# Altium project PS Digital Test v1.0.0.PrjPcb
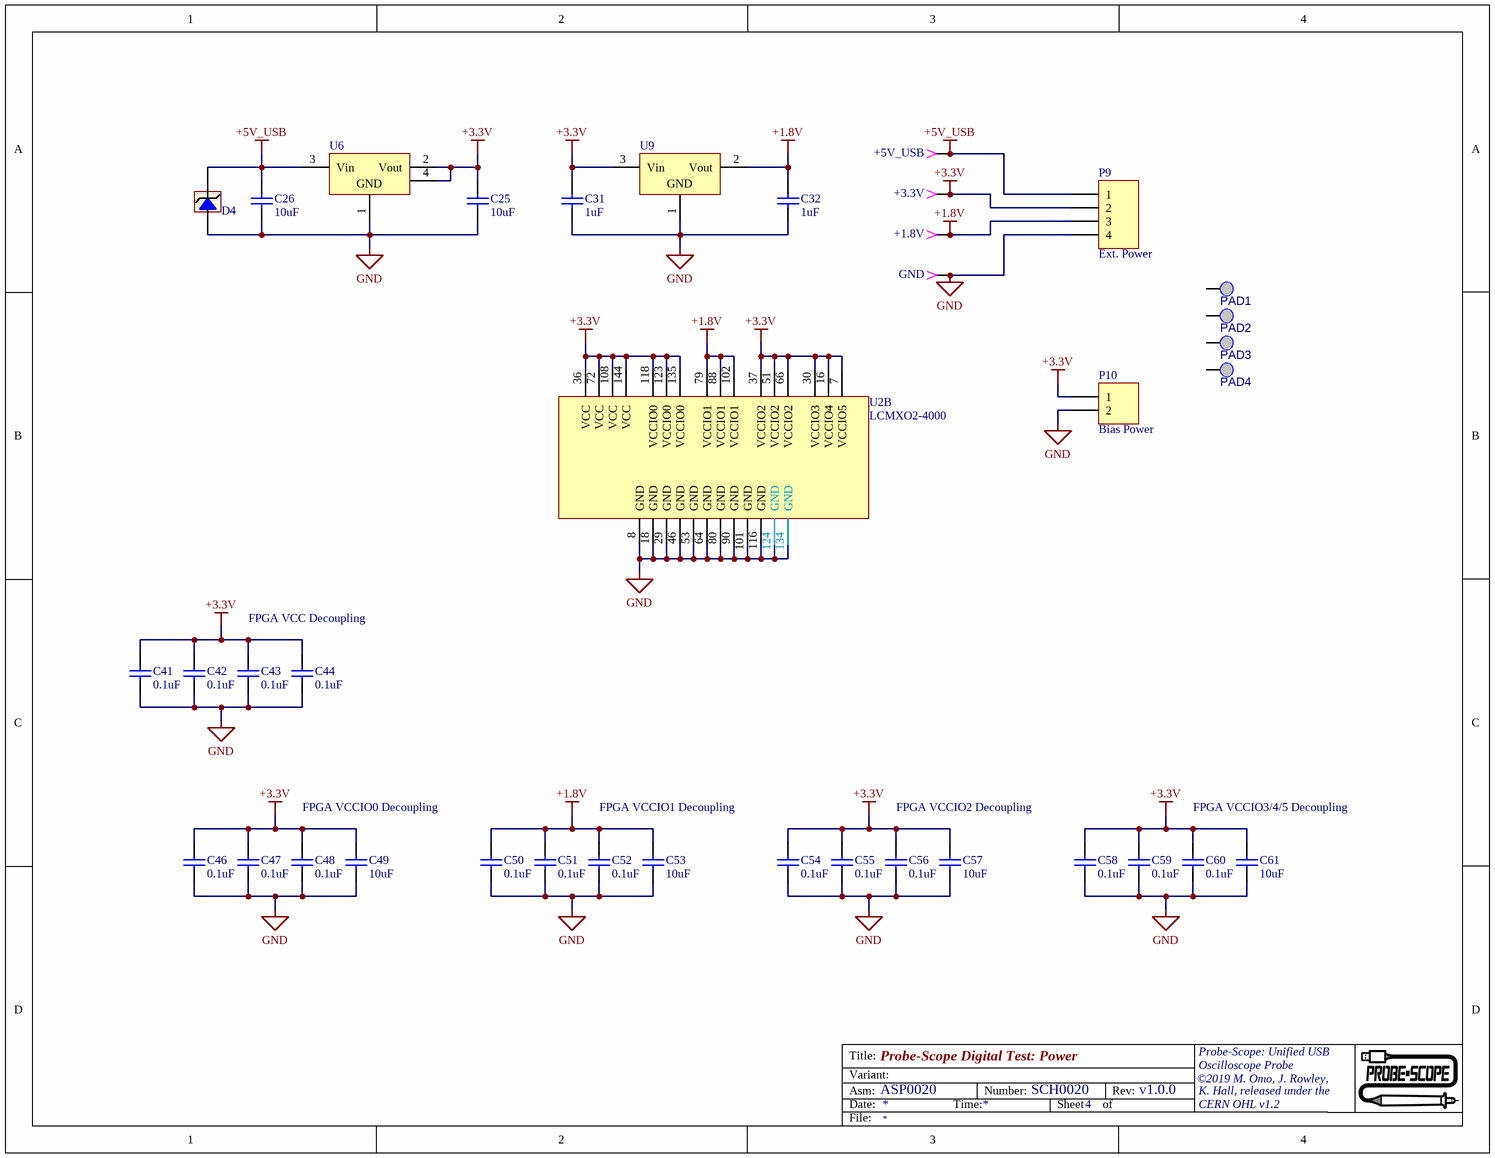
[diagram p0: PSDT Power v1.0.0.SchDoc]
sheetcount: 4; revisionfull: v1.0.0; revision: v1.0
4 sheets, 120 parts. Net scope: global (net labels, ports and power ports of the same name join across sheets).
Board file: PS Digital Test v1.0.PcbDoc
Sheets:
  PSDT Power v1.0.0.SchDoc
  PSDT RAM v1.0.0.SchDoc
  PSDT Controller v1.0.0.SchDoc
  PSDT ADC v1.0.0.SchDoc

## Sheet PSDT Power v1.0.0.SchDoc: Probe-Scope Digital Test: Power
size Letter; CompanyName: Probe-Scope; Organization: Probe-Scope; Address1: Probe-Scope: Unified USB; Address2: Oscilloscope Probe; Address3: ©2019 M. Omo, J. Rowley,; Address4: K. Hall, released under the; DocumentNumber: SCH0020; SheetNumber: 4; SheetTotal: 4; PageSetup: Record=PageOptions|CenterHorizontal=True|CenterVertical=True|PrintScale=0.96|XCorrection=1.00|YCorrection=1.00|PrintKind=1|BorderSize=5000000|LeftOffset=0|BottomOffset=0|Orientation=2|PaperLength=1000|PaperWidth=1000|Scale=100|PaperSource=7|PrintQuality=-4|MediaType=1|DitherType=10|PaperKind=11x17|PrintScaleMode=1; Assembly: ASP0020; License: CERN OHL v1.2

### Parts
+1.8V  TP  [TESTPOINT024]  (value not drawn)
+3.3V  TP  [TESTPOINT024]  (value not drawn)
+5V_USB  TP  [TESTPOINT024]  (value not drawn)
C25  value 10uF  [0603(1608)]  (hidden comment: 25V)
C26  value 10uF  [0603(1608)]  (hidden comment: 25V)
C31  value 1uF  [0402(1005)]  (hidden comment: 10V)
C32  value 1uF  [0402(1005)]  (hidden comment: 10V)
C41  value 0.1uF  [0402(1005)]  (hidden comment: 6.3V)
C42  value 0.1uF  [0402(1005)]  (hidden comment: 6.3V)
C43  value 0.1uF  [0402(1005)]  (hidden comment: 6.3V)
C44  value 0.1uF  [0402(1005)]  (hidden comment: 6.3V)
C46  value 0.1uF  [0402(1005)]  (hidden comment: 6.3V)
C47  value 0.1uF  [0402(1005)]  (hidden comment: 6.3V)
C48  value 0.1uF  [0402(1005)]  (hidden comment: 6.3V)
C49  value 10uF  [0603(1608)]  (hidden comment: 25V)
C50  value 0.1uF  [0402(1005)]  (hidden comment: 6.3V)
C51  value 0.1uF  [0402(1005)]  (hidden comment: 6.3V)
C52  value 0.1uF  [0402(1005)]  (hidden comment: 6.3V)
C53  value 10uF  [0603(1608)]  (hidden comment: 25V)
C54  value 0.1uF  [0402(1005)]  (hidden comment: 6.3V)
C55  value 0.1uF  [0402(1005)]  (hidden comment: 6.3V)
C56  value 0.1uF  [0402(1005)]  (hidden comment: 6.3V)
C57  value 10uF  [0603(1608)]  (hidden comment: 25V)
C58  value 0.1uF  [0402(1005)]  (hidden comment: 6.3V)
C59  value 0.1uF  [0402(1005)]  (hidden comment: 6.3V)
C60  value 0.1uF  [0402(1005)]  (hidden comment: 6.3V)
C61  value 10uF  [0603(1608)]  (hidden comment: 25V)
D4  6.5V  [SMB NP]  (value not drawn)
GND  TP  [TESTPOINT024]  (value not drawn)
P9  Ext. Power  [0.1HDR1X4P]
P10  Bias Power  [0.1HDR1X2P]
PAD1  4-40 Loose  [PAD-4-40 Loose]  (value not drawn)  (no BOM)
PAD2  4-40 Loose  [PAD-4-40 Loose]  (value not drawn)  (no BOM)
PAD3  4-40 Loose  [PAD-4-40 Loose]  (value not drawn)  (no BOM)
PAD4  4-40 Loose  [PAD-4-40 Loose]  (value not drawn)  (no BOM)
U2  LCMXO2-4000  [UL_TQFP144]  (part B of 5)
U6  LD1086D2M33TR  [D2PAK TO263-4N]  (value not drawn)
U9  1.8V  [SOT23-12-3TOP]  (value not drawn)

### Nets
+1.8V: +1.8V.1 C32.2 C50.2 C51.2 C52.2 C53.2 P9.3 U2.79(VCCIO1) U2.88(VCCIO1) U2.102(VCCIO1) U9.2(Vout)
+3.3V: +3.3V.1 C25.2 C31.2 C41.2 C42.2 C43.2 C44.2 C46.2 C47.2 C48.2 C49.2 C54.2 C55.2 C56.2 C57.2 C58.2 C59.2 C60.2 C61.2 P9.2 P10.1 U2.7(VCCIO5) U2.16(VCCIO4) U2.30(VCCIO3) U2.36(VCC) U2.37(VCCIO2) U2.51(VCCIO2) U2.66(VCCIO2) U2.72(VCC) U2.108(VCC) U2.118(VCCIO0) U2.123(VCCIO0) U2.135(VCCIO0) U2.144(VCC) U6.2(Vout) U6.4(GND) U9.3(Vin)
+5V_USB: +5V_USB.1 C26.2 D4.2 P9.1 U6.3(Vin)
GND: C25.1 C26.1 C31.1 C32.1 C41.1 C42.1 C43.1 C44.1 C46.1 C47.1 C48.1 C49.1 C50.1 C51.1 C52.1 C53.1 C54.1 C55.1 C56.1 C57.1 C58.1 C59.1 C60.1 C61.1 D4.1 GND.1 P9.4 P10.2 U2.8(GND) U2.18(GND) U2.29(GND) U2.46(GND) U2.53(GND) U2.64(GND) U2.80(GND) U2.90(GND) U2.101(GND) U2.116(GND) U2.124(GND) U2.134(GND) U6.1(GND) U9.1(GND)

Not connected (* = marked no-connect by the designer): PAD1 1; PAD2 1; PAD3 1; PAD4 1

### Notes on the sheet
- FPGA VCC Decoupling
- FPGA VCCIO0 Decoupling
- FPGA VCCIO1 Decoupling
- FPGA VCCIO2 Decoupling
- FPGA VCCIO3/4/5 Decoupling
- Title:
- Asm:
- Date:
- Variant:
- Time:
- Number:
- Sheet
- of
- Rev:
- File:

### Library data of the parts
+1.8V +3.3V +5V_USB GND = 49: Key: 49; MENG_PN: CON00002; MANF: Keystone Electronics; MANF_PN: 1998-3; VENDOR: Digikey; VENDOR_PN: 1998-3K-ND; P&V Description: Connector, Test Point, 1 Positions, Male, Small, 0.27" Straight Pin, 0.02" dia; Class: Connector; Other: Small, 0.27" Straight Pin, 0.02" dia; Approved: True; Positions: 1; Sex: Male; Type: Test Point; SMD: False; Date Modified: 9/30/2014 10:31:54 AM; Parent Key: 49; Verified: True; Modified By: sotterbacher
C25 C26 C49 C53 C57 C61 = 1306: Key: 1306; MENG_PN: ???1306; MANF: Samsung Electro-Mechanics; MANF_PN: CL10A106MA8NRNC; VENDOR: Digikey; VENDOR_PN: 1276-1869-1-ND; P&V Description: Capacitor, Ceramic, 10uF, 25V, 20% Tol, 85C, X5R, 0603, SMD; Class: Capacitor; Type: Ceramic; Other: X5R; Tolerance: 20; Voltage: 25; Max Temperature: 85; Approved: True; Package: 0603; SMD: True; Date Modified: 3/3/2015 11:08:29 AM; Modified By: sotterbacher; Parent Key: 1306; Verified: True
C31 C32 = 1876: Key: 1876; MENG_PN: ???1876; MANF: Murata Electronics; MANF_PN: GCM155C71A105KE38D; VENDOR: Digikey; VENDOR_PN: 490-13409-1-ND; P&V Description: Capacitor, Ceramic, 1uF, 10V, 10% Tol, 125C, X7S, 0402, SMD; Class: Capacitor; Type: Ceramic; Other: X7S; Tolerance: 10; Max Temperature: 125; Approved: False; Package: 0402; SMD: True; Date Modified: 11/6/2018 11:19:13 AM; Modified By: jrowley; Voltage: 10; Parent Key: 1876; Verified: False
C41-C44 C46-C48 C50-C52 C54-C56 C58-C60 = 1875: Key: 1875; MENG_PN: ???1875; MANF: Samsung Electro-Mechanics; MANF_PN: CL05B104KQ5NNNC; VENDOR: Digikey; VENDOR_PN: 1276-1511-1-ND; P&V Description: Capacitor, Ceramic, 0.1uF, 6.3V, 10% Tol, 125C, X7R, 0402, SMD; Class: Capacitor; Type: Ceramic; Other: X7R; Tolerance: 10; Voltage: 6.3; Max Temperature: 125; Approved: False; Package: 0402; SMD: True; Date Modified: 11/6/2018 11:14:02 AM; Modified By: jrowley; Parent Key: 1875; Verified: False
D4 = 1447: Key: 1447; MENG_PN: ???1447; MANF: Littelfuse; MANF_PN: SMBJ6.5A; VENDOR: Digikey; VENDOR_PN: SMBJ6.5ALFCT-ND; P&V Description: Diode, Transzorb, 6.5V, 53.6A, 600W, V breakdoen min 7.22V, Voltage Clamping Max 11.2V, Unidirectional Zener Clamp, TVS, Circuit Protection, SMB, SMD; Class: Diode; Other: V breakdoen min 7.22V, Voltage Clamping Max 11.2V, Unidirectional Zener Clamp, TVS, Circuit Protection; Voltage: 6.5; Current: 53.6; Power: 600; Approved: True; Type: Transzorb; Package: SMB; SMD: True; Date Modified: 4/13/2016 2:45:26 PM; Modified By: tgage; Parent Key: 1447; Verified: True
P9 = 163: Key: 163; MENG_PN: CON00029; MANF: Molex; VENDOR: Digikey; VENDOR_PN: WM2702-ND; P&V Description: Connector, Header, 0.1", 4 Positions, Male, 0.1" Spacing, 4A, 250V, 0.24" Long, 0.125" Tail, 15u" Select Gold, Polarized, Locking Ramp, Vert; Class: Connector; Other: 0.24" Long, 0.125" Tail, 15u" Select Gold, Polarized, Locking Ramp, Vert; Current: 4; Voltage: 250; Spacing: 0.1; Sex: Male; Approved: False; MANF_PN: 22-11-2042; Type: Header, 0.1"; SMD: False; Date Modified: 7/21/2017 2:27:52 PM; Modified By: jrowley; Positions: 4; Parent Key: 163; Verified: False
P10 = 375: Key: 375; MENG_PN: CON00068; MANF: Molex; VENDOR: Digikey; VENDOR_PN: WM2700-ND; P&V Description: Connector, Header, 0.1", 2 Positions, Male, 0.1" Spacing, 4A, 250V, 0.24" Long, 0.125" Tail, 15u Select Gold, Polarized, Locking Ramp; Class: Connector; Other: 0.24" Long, 0.125" Tail, 15u Select Gold, Polarized, Locking Ramp; Current: 4; Voltage: 250; Positions: 2; Spacing: 0.1; Sex: Male; Approved: False; MANF_PN: 22-11-2022; Type: Header, 0.1"; SMD: False; Date Modified: 7/21/2017 2:28:28 PM; Modified By: jrowley; Parent Key: 375; Verified: False
PAD1-PAD4 = 671: Key: 671; MENG_PN: ???671; MANF: dummy; MANF_PN: 000-671; P&V Description: Fabrication, Hole, 4-40 Pad, Loose Fit, Not a Part; Class: Fabrication; Other: 4-40 Pad, Loose Fit, Not a Part; Approved: True; VENDOR: dummy; Type: Hole; SMD: False; Date Modified: 11/19/2010 2:33:14 PM; Modified By: pmarcus; Parent Key: 671; Verified: True
U2 = MachXO2-4000-TG144: MANF: Lattice Semiconductor Corporation; MANF_PN: LCMXO2-4000HC-4TG144C; VENDOR: DigiKey; VENDOR_PN: 220-1460-ND
U6 = 690: Key: 690; MENG_PN: ANG00046; MANF: ST Microelectronics; VENDOR: Digikey; VENDOR_PN: 497-1223-1-ND; P&V Description: IC, Voltage Regulator, 3.3V, 1.5A max Iout, 30V Max Vin, DPAK-3, SMD; Class: IC; Other: 3.3V, 1.5A max Iout, 30V Max Vin; Approved: True; MANF_PN: LD1086D2M33TR; Type: Voltage Regulator; Package: DPAK-3; SMD: True; Date Modified: 4/8/2011 3:28:12 PM; Modified By: cschneiker; Parent Key: 690; Verified: True
U9 = 2073: Key: 2073; MENG_PN: ???2073; MANF: Microchip; MANF_PN: MCP1703T-1802E/CB; VENDOR: Digikey; VENDOR_PN: MCP1703T-1802E/CBCT-ND; P&V Description: IC, Voltage Regulator, 1.8Vout, 2.7-16Vin, 200mA, -40°C ~ 125°C, SOT-23, SMD; Class: IC; Other: 1.8Vout, 2.7-16Vin, 200mA, -40°C ~ 125°C; Approved: False; Type: Voltage Regulator; Package: SOT-23; SMD: True; Date Modified: 6/21/2019 8:23:33 PM; Modified By: jrowley; Parent Key: 2073; Verified: False

## Sheet PSDT RAM v1.0.0.SchDoc: Probe-Scope Digital Test: RAM
size Letter; CompanyName: Probe-Scope; Organization: Probe-Scope; Address1: Probe-Scope: Unified USB; Address2: Oscilloscope Probe; Address3: ©2019 M. Omo, J. Rowley,; Address4: K. Hall, released under the; DocumentNumber: SCH0020; SheetNumber: 3; SheetTotal: 4; PageSetup: Record=PageOptions|CenterHorizontal=True|CenterVertical=True|PrintScale=0.96|XCorrection=1.00|YCorrection=1.00|PrintKind=1|BorderSize=5000000|LeftOffset=0|BottomOffset=0|Orientation=2|PaperLength=1000|PaperWidth=1000|Scale=100|PaperSource=7|PrintQuality=-4|MediaType=1|DitherType=10|PaperKind=11x17|PrintScaleMode=1; Assembly: ASP0020; License: CERN OHL v1.2
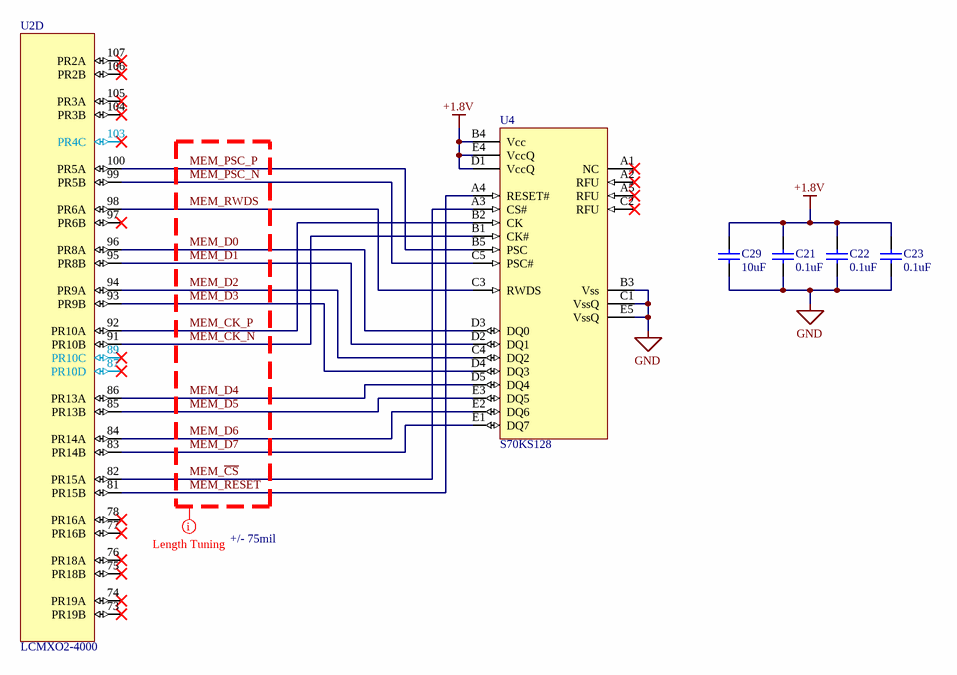
[diagram p1: PSDT RAM v1.0.0.SchDoc]

### Parts
C21  value 0.1uF  [0402(1005)]  (hidden comment: 6.3V)
C22  value 0.1uF  [0402(1005)]  (hidden comment: 6.3V)
C23  value 0.1uF  [0402(1005)]  (hidden comment: 6.3V)
C29  value 10uF  [0603(1608)]  (hidden comment: 25V)
U2  LCMXO2-4000  [UL_TQFP144]  (part D of 5)
U4  S70KS128  [Cypress-VAA024]

### Nets
+1.8V: C21.2 C22.2 C23.2 C29.2 U4.B4(Vcc) U4.D1(VccQ) U4.E4(VccQ)
GND: C21.1 C22.1 C23.1 C29.1 U4.B3(Vss) U4.C1(VssQ) U4.E5(VssQ)
MEM_~{CS}: U2.82(PR15A) U4.A3(CS#)
MEM_CK_N: U2.91(PR10B) U4.B1(CK#)
MEM_CK_P: U2.92(PR10A) U4.B2(CK)
MEM_D0: U2.96(PR8A) U4.D3(DQ0)
MEM_D1: U2.95(PR8B) U4.D2(DQ1)
MEM_D2: U2.94(PR9A) U4.C4(DQ2)
MEM_D3: U2.93(PR9B) U4.D4(DQ3)
MEM_D4: U2.86(PR13A) U4.D5(DQ4)
MEM_D5: U2.85(PR13B) U4.E3(DQ5)
MEM_D6: U2.84(PR14A) U4.E2(DQ6)
MEM_D7: U2.83(PR14B) U4.E1(DQ7)
MEM_PSC_N: U2.99(PR5B) U4.C5(PSC#)
MEM_PSC_P: U2.100(PR5A) U4.B5(PSC)
MEM_~{RESET}: U2.81(PR15B) U4.A4(RESET#)
MEM_RWDS: U2.98(PR6A) U4.C3(RWDS)

Not connected (* = marked no-connect by the designer): U2 73(PR19B)* 74(PR19A)* 75(PR18B)* 76(PR18A)* 77(PR16B)* 78(PR16A)* 87(PR10D)* 89(PR10C)* 97(PR6B)* 103(PR4C)* 104(PR3B)* 105(PR3A)* 106(PR2B)* 107(PR2A)*; U4 A1(NC)* A2(RFU)* A5(RFU)* C2(RFU)*

### Layout directives
net class MEMDDR - 150mil: MEM_CK_N, MEM_CK_P, MEM_D0, MEM_D1, MEM_D2, MEM_D3, MEM_D4, MEM_D5, MEM_D6, MEM_D7, MEM_PSC_N, MEM_PSC_P, MEM_RWDS, MEM_~{CS}, MEM_~{RESET}

### Notes on the sheet
- +/- 75mil
- Title:
- Asm:
- Date:
- Variant:
- Time:
- Number:
- Sheet
- of
- Rev:
- File:

### Library data of the parts
C21-C23 = 1875: as C41 on sheet PSDT Power v1.0.0; Package: 0402; SMD: True; Date Modified: 11/6/2018 11:14:02 AM; Modified By: jrowley; Parent Key: 1875; Verified: False
C29 = 1306: as C25 on sheet PSDT Power v1.0.0; Package: 0603; SMD: True; Date Modified: 3/3/2015 11:08:29 AM; Modified By: sotterbacher; Parent Key: 1306; Verified: True
U2 = MachXO2-4000-TG144: as U2 on sheet PSDT Power v1.0.0
U4 = S70KS: MANF: Cypress; MANF_PN: S70KS1281DPBHV020; VENDOR: DigiKey; VENDOR_PN: 2015-S70KS1281DPBHV020-ND

## Sheet PSDT Controller v1.0.0.SchDoc: Probe-Scope Digital Test: Controller
size Tabloid; CompanyName: Probe-Scope; Organization: Probe-Scope; Address1: Probe-Scope: Unified USB; Address2: Oscilloscope Probe; Address3: ©2019 M. Omo, J. Rowley,; Address4: K. Hall, released under the; DocumentNumber: SCH0020; SheetNumber: 1; SheetTotal: 4; PageSetup: Record=PageOptions|CenterHorizontal=True|CenterVertical=True|PrintScale=0.96|XCorrection=1.00|YCorrection=1.00|PrintKind=1|BorderSize=5000000|LeftOffset=0|BottomOffset=0|Orientation=2|PaperLength=1000|PaperWidth=1000|Scale=100|PaperSource=7|PrintQuality=-4|MediaType=1|DitherType=10|PaperKind=11x17|PrintScaleMode=1; Assembly: ASP0020; License: CERN OHL v1.2
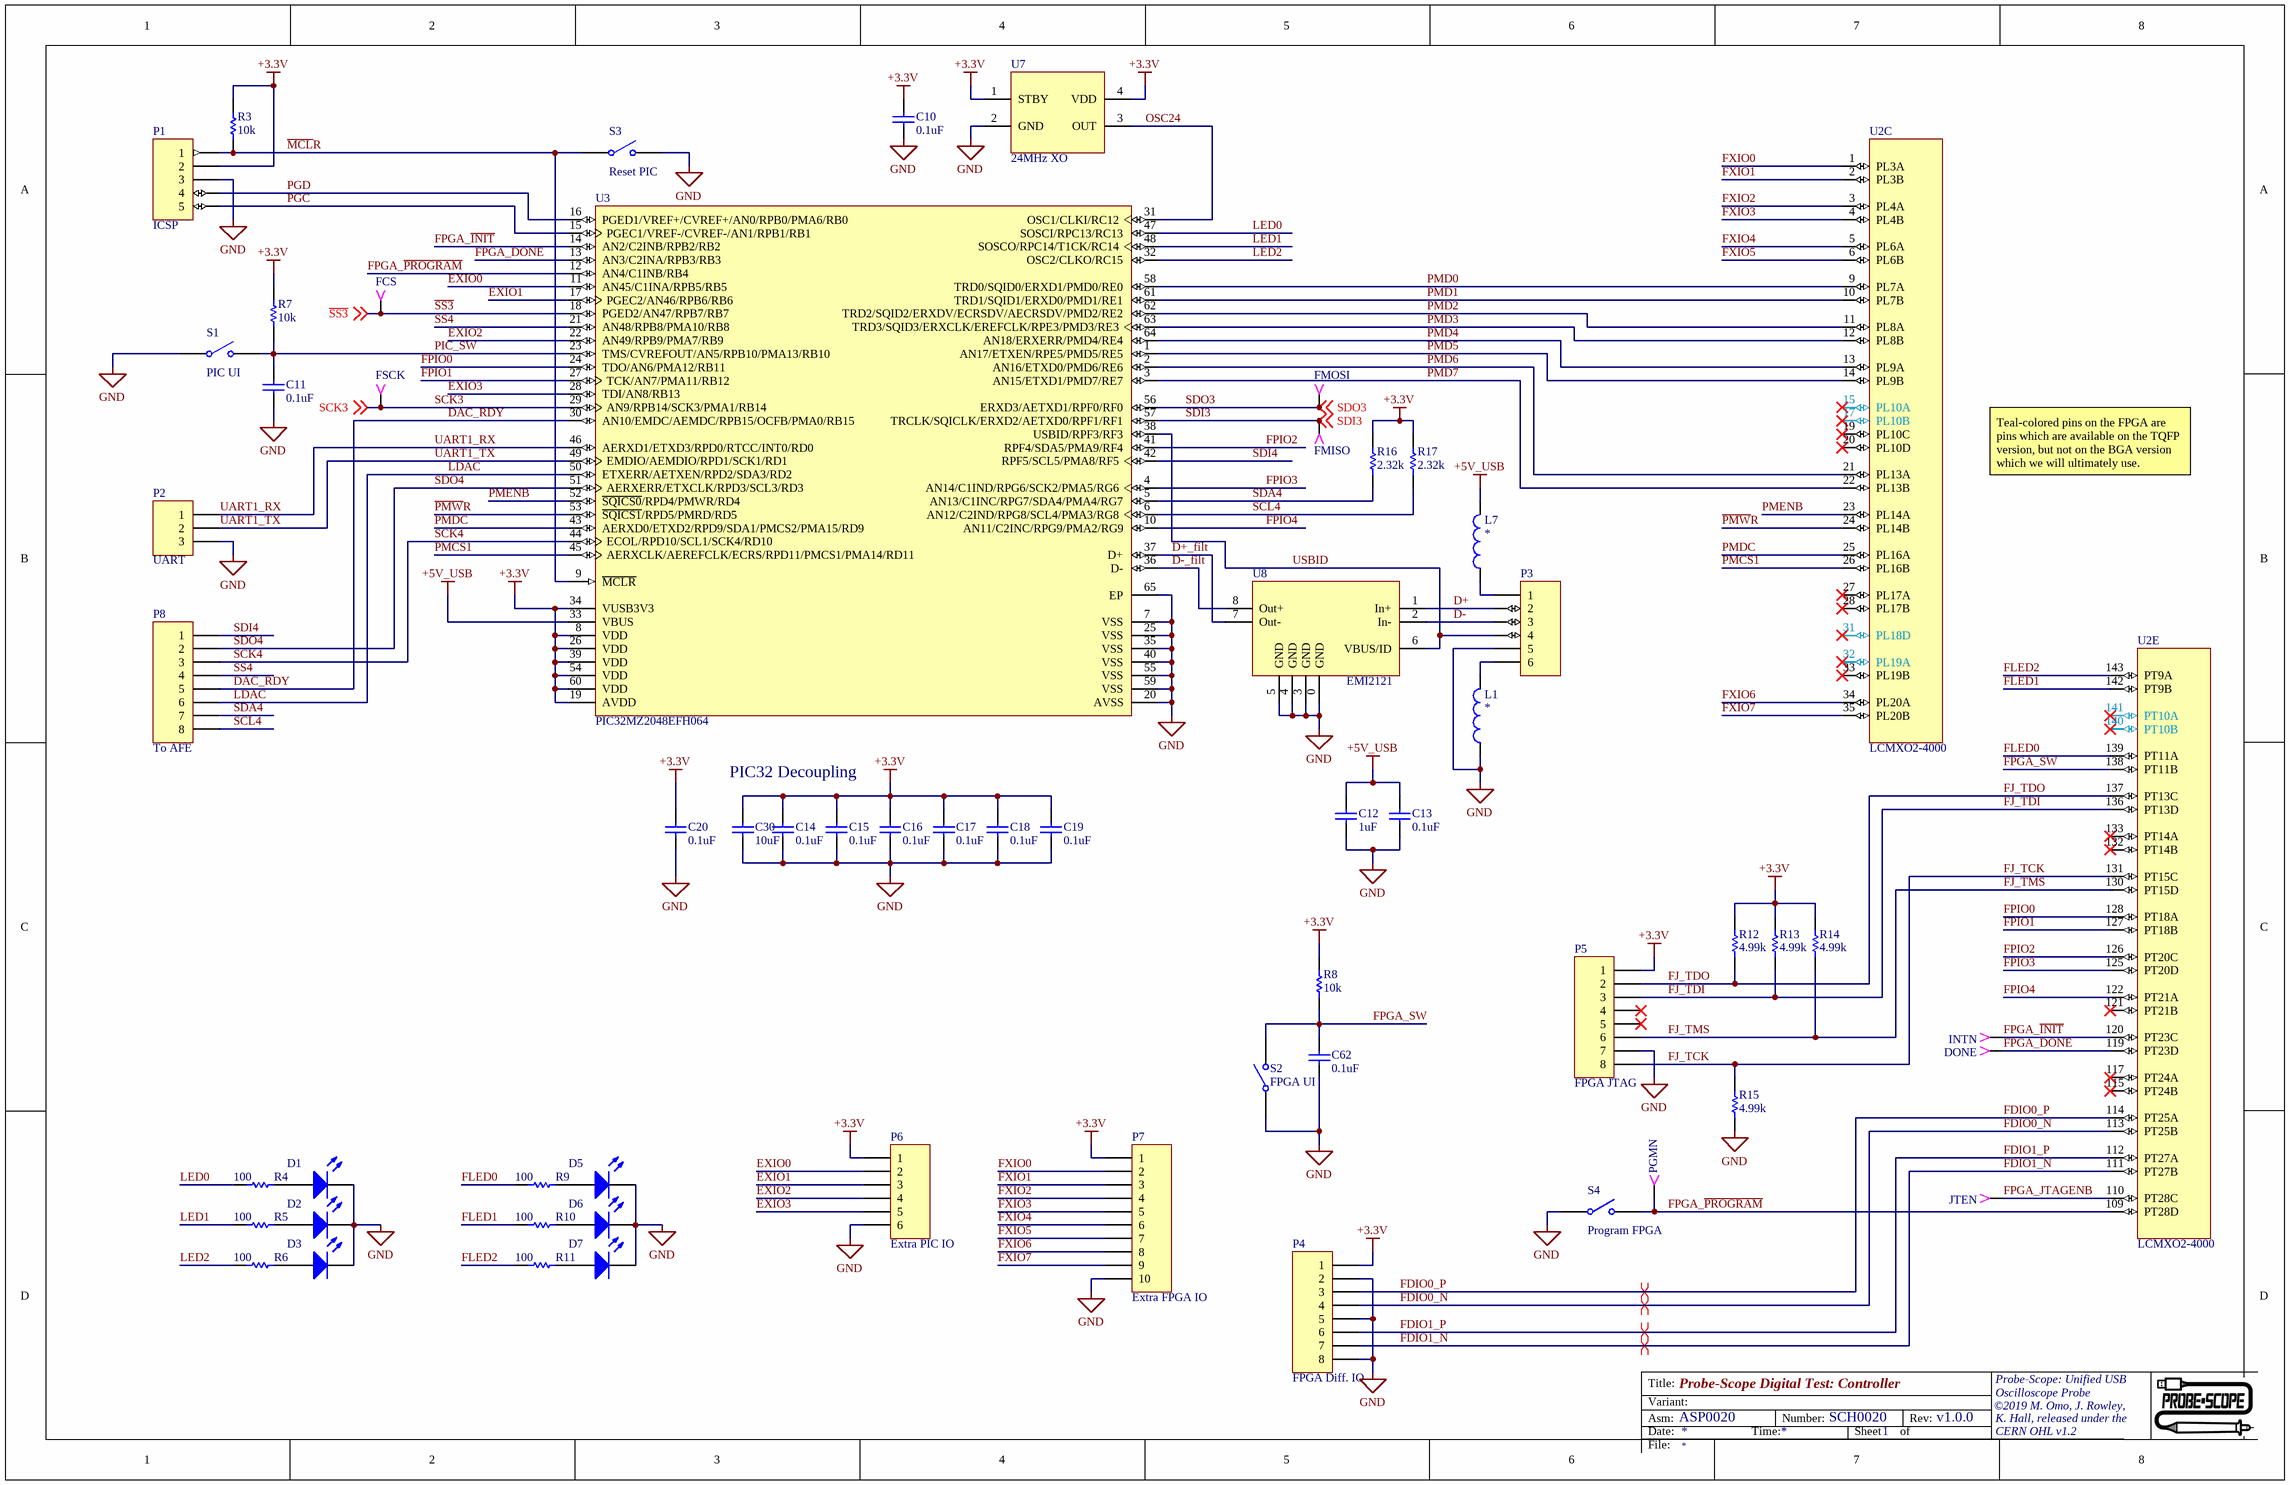
[diagram p2: PSDT Controller v1.0.0.SchDoc]

### Parts
C10  value 0.1uF  [0402(1005)]  (hidden comment: 6.3V)
C11  value 0.1uF  [0402(1005)]  (hidden comment: 6.3V)
C12  value 1uF  [0402(1005)]  (hidden comment: 10V)
C13  value 0.1uF  [0402(1005)]  (hidden comment: 6.3V)
C14  value 0.1uF  [0402(1005)]  (hidden comment: 6.3V)
C15  value 0.1uF  [0402(1005)]  (hidden comment: 6.3V)
C16  value 0.1uF  [0402(1005)]  (hidden comment: 6.3V)
C17  value 0.1uF  [0402(1005)]  (hidden comment: 6.3V)
C18  value 0.1uF  [0402(1005)]  (hidden comment: 6.3V)
C19  value 0.1uF  [0402(1005)]  (hidden comment: 6.3V)
C20  value 0.1uF  [0402(1005)]  (hidden comment: 6.3V)
C30  value 10uF  [0603(1608)]  (hidden comment: 25V)
C62  value 0.1uF  [0402(1005)]  (hidden comment: 6.3V)
D1  Green  [0603(1608) LED]  (value not drawn)
D2  Green  [0603(1608) LED]  (value not drawn)
D3  Green  [0603(1608) LED]  (value not drawn)
D5  Green  [0603(1608) LED]  (value not drawn)
D6  Green  [0603(1608) LED]  (value not drawn)
D7  Green  [0603(1608) LED]  (value not drawn)
DONE  TP  [TESTPOINT024]  (value not drawn)
FCS  TP  [TESTPOINT024]  (value not drawn)
FMISO  TP  [TESTPOINT024]  (value not drawn)
FMOSI  TP  [TESTPOINT024]  (value not drawn)
FSCK  TP  [TESTPOINT024]  (value not drawn)
INTN  TP  [TESTPOINT024]  (value not drawn)
JTEN  TP  [TESTPOINT024]  (value not drawn)
L1  Ferrite Bead  [0402(1005)]  (value not drawn)
L7  Ferrite Bead  [0402(1005)]  (value not drawn)
P1  ICSP  [MOLEX PICOBLADE 5 POS]
P2  UART  [MOLEX PICOBLADE 3 POS]
P3  Micro USB  [USB Micro B ZX62]  (value not drawn)
P4  FPGA Diff. IO  [0.1HDR1X8P]
P5  FPGA JTAG  [0.1HDR1X8P]
P6  Extra PIC IO  [0.1HDR1X6P]
P7  Extra FPGA IO  [0.1HDR1X10P]
P8  To AFE  [0.1HDR1X8P]
PGMN  TP  [TESTPOINT024]  (value not drawn)
R3  value 10k  [0402(1005)]  (hidden comment: 0.1% 25ppm)
R4  value 100  [0402(1005)]  (hidden comment: Res1)
R5  value 100  [0402(1005)]  (hidden comment: Res1)
R6  value 100  [0402(1005)]  (hidden comment: Res1)
R7  value 10k  [0402(1005)]  (hidden comment: 0.1% 25ppm)
R8  value 10k  [0402(1005)]  (hidden comment: 0.1% 25ppm)
R9  value 100  [0402(1005)]  (hidden comment: Res1)
R10  value 100  [0402(1005)]  (hidden comment: Res1)
R11  value 100  [0402(1005)]  (hidden comment: Res1)
R12  value 4.99k  [0402(1005)]  (hidden comment: Res1)
R13  value 4.99k  [0402(1005)]  (hidden comment: Res1)
R14  value 4.99k  [0402(1005)]  (hidden comment: Res1)
R15  value 4.99k  [0402(1005)]  (hidden comment: Res1)
R16  value 2.32k  [0402(1005)]  (hidden comment: Res1)
R17  value 2.32k  [0402(1005)]  (hidden comment: Res1)
S1  PIC UI  [PTS645 SMT]
S2  FPGA UI  [PTS645 SMT]
S3  Reset PIC  [PTS645 SMT]
S4  Program FPGA  [PTS645 SMT]
U2  LCMXO2-4000  [UL_TQFP144]  (parts C,E of 5)
U3  PIC32MZ2048EFH064  [QFN50P900X900-64N]
U7  24MHz XO  [DSC60xxC]
U8  EMI2121  [EMI2121]

### Nets
+3.3V: C10.2 C14.2 C15.2 C16.2 C17.2 C18.2 C19.2 C20.2 C30.2 P1.2 P4.1 P5.1 P6.1 P7.1 R3.2 R7.1 R8.1 R12.2 R13.2 R14.2 R16.2 R17.2 U3.8(VDD) U3.19(AVDD) U3.26(VDD) U3.34(VUSB3V3) U3.39(VDD) U3.54(VDD) U3.60(VDD) U7.1(STBY) U7.4(VDD)
+5V_USB: C12.2 C13.2 L7.2 U3.33(VBUS)
GND: C10.1 C11.1 C12.1 C13.1 C14.1 C15.1 C16.1 C17.1 C18.1 C19.1 C20.1 C30.1 C62.1 D1.2(K) D2.2(K) D3.2(K) D5.2(K) D6.2(K) D7.2(K) L1.1 P1.3 P2.3 P3.5 P4.2 P4.5 P4.8 P5.7 P6.6 P7.10 R15.1 S1.1(COMMON) S2.1(COMMON) S3.2(NO) S4.1(COMMON) U3.7(VSS) U3.20(AVSS) U3.25(VSS) U3.35(VSS) U3.40(VSS) U3.55(VSS) U3.59(VSS) U3.65(EP) U7.2(GND) U8.0(GND) U8.3(GND) U8.4(GND) U8.5(GND)
~{MCL}R: P1.1 R3.1 S3.1(COMMON) U3.9(~{MCLR})
~{PMW}R: U2.24(PL14B) U3.53(~{SQICS1}/RPD5/PMRD/RD5)
D+: P3.2 U8.1(In+)
D+_filt: U3.37(D+) U8.7(Out-)
D-: P3.3 U8.2(In-)
D-_filt: U3.36(D-) U8.8(Out+)
DAC_RDY: P8.5 U3.30(AN10/EMDC/AEMDC/RPB15/OCFB/PMA0/RB15)
EXIO0: P6.2 U3.11(AN45/C1INA/RPB5/RB5)
EXIO1: P6.3 U3.17(PGEC2/AN46/RPB6/RB6)
EXIO2: P6.4 U3.22(AN49/RPB9/PMA7/RB9)
EXIO3: P6.5 U3.28(TDI/AN8/RB13)
FDIO0_N: P4.4 U2.113(PT25B)
FDIO0_P: P4.3 U2.114(PT25A)
FDIO1_N: P4.7 U2.111(PT27B)
FDIO1_P: P4.6 U2.112(PT27A)
FJ_TCK: P5.8 R15.2 U2.131(PT15C)
FJ_TDI: P5.3 R13.1 U2.136(PT13D)
FJ_TDO: P5.2 R12.1 U2.137(PT13C)
FJ_TMS: P5.6 R14.1 U2.130(PT15D)
FLED0: R9.1 U2.139(PT11A)
FLED1: R10.1 U2.142(PT9B)
FLED2: R11.1 U2.143(PT9A)
FPGA_DONE: DONE.1 U2.119(PT23D) U3.13(AN3/C2INA/RPB3/RB3)
FPGA_~{INIT}: INTN.1 U2.120(PT23C) U3.14(AN2/C2INB/RPB2/RB2)
FPGA_JTAGENB: JTEN.1 U2.110(PT28C)
FPGA_~{PROGRAM}: PGMN.1 S4.2(NO) U2.109(PT28D) U3.12(AN4/C1INB/RB4)
FPGA_SW: C62.2 R8.2 S2.2(NO) U2.138(PT11B)
FPIO0: U2.128(PT18A) U3.24(TDO/AN6/PMA12/RB11)
FPIO1: U2.127(PT18B) U3.27(TCK/AN7/PMA11/RB12)
FPIO2: U2.126(PT20C) U3.41(RPF4/SDA5/PMA9/RF4)
FPIO3: U2.125(PT20D) U3.4(AN14/C1IND/RPG6/SCK2/PMA5/RG6)
FPIO4: U2.122(PT21A) U3.10(AN11/C2INC/RPG9/PMA2/RG9)
FXIO0: P7.2 U2.1(PL3A)
FXIO1: P7.3 U2.2(PL3B)
FXIO2: P7.4 U2.3(PL4A)
FXIO3: P7.5 U2.4(PL4B)
FXIO4: P7.6 U2.5(PL6A)
FXIO5: P7.7 U2.6(PL6B)
FXIO6: P7.8 U2.34(PL20A)
FXIO7: P7.9 U2.35(PL20B)
~{LDAC}: P8.6 U3.50(ETXERR/AETXEN/RPD2/SDA3/RD2)
LED0: R4.1 U3.47(SOSCI/RPC13/RC13)
LED1: R5.1 U3.48(SOSCO/RPC14/T1CK/RC14)
LED2: R6.1 U3.32(OSC2/CLKO/RC15)
OSC24: U3.31(OSC1/CLKI/RC12) U7.3(OUT)
PGC: P1.5 U3.15(PGEC1/VREF-/CVREF-/AN1/RPB1/RB1)
PGD: P1.4 U3.16(PGED1/VREF+/CVREF+/AN0/RPB0/PMA6/RB0)
PIC_SW: C11.2 R7.2 S1.2(NO) U3.23(TMS/CVREFOUT/AN5/RPB10/PMA13/RB10)
PMCS1: U2.26(PL16B) U3.45(AERXCLK/AEREFCLK/ECRS/RPD11/PMCS1/PMA14/RD11)
PMD0: U2.9(PL7A) U3.58(TRD0/SQID0/ERXD1/PMD0/RE0)
PMD1: U2.10(PL7B) U3.61(TRD1/SQID1/ERXD0/PMD1/RE1)
PMD2: U2.11(PL8A) U3.62(TRD2/SQID2/ERXDV/ECRSDV/AECRSDV/PMD2/RE2)
PMD3: U2.12(PL8B) U3.63(TRD3/SQID3/ERXCLK/EREFCLK/RPE3/PMD3/RE3)
PMD4: U2.13(PL9A) U3.64(AN18/ERXERR/PMD4/RE4)
PMD5: U2.14(PL9B) U3.1(AN17/ETXEN/RPE5/PMD5/RE5)
PMD6: U2.21(PL13A) U3.2(AN16/ETXD0/PMD6/RE6)
PMD7: U2.22(PL13B) U3.3(AN15/ETXD1/PMD7/RE7)
PMDC: U2.25(PL16A) U3.43(AERXD0/ETXD2/RPD9/SDA1/PMCS2/PMA15/RD9)
PMENB: U2.23(PL14A) U3.52(~{SQICS0}/RPD4/PMWR/RD4)
~{SS3}: FCS.1 U3.18(PGED2/AN47/RPB7/RB7) ; off-sheet ~{SS3}
~{SS4}: P8.4 U3.21(AN48/RPB8/PMA10/RB8)
SCK3: FSCK.1 U3.29(AN9/RPB14/SCK3/PMA1/RB14) ; off-sheet SCK3
SCK4: P8.3 U3.44(ECOL/RPD10/SCL1/SCK4/RD10)
SCL4: P8.8 R17.1 U3.6(AN12/C2IND/RPG8/SCL4/PMA3/RG8)
SDA4: P8.7 R16.1 U3.5(AN13/C1INC/RPG7/SDA4/PMA4/RG7)
SDI3: FMISO.1 U3.57(TRCLK/SQICLK/ERXD2/AETXD0/RPF1/RF1) ; off-sheet SDI3
SDI4: P8.1 U3.42(RPF5/SCL5/PMA8/RF5)
SDO3: FMOSI.1 U3.56(ERXD3/AETXD1/RPF0/RF0) ; off-sheet SDO3
SDO4: P8.2 U3.51(AERXERR/ETXCLK/RPD3/SCL3/RD3)
UART1_RX: P2.1 U3.46(AERXD1/ETXD3/RPD0/RTCC/INT0/RD0)
UART1_TX: P2.2 U3.49(EMDIO/AEMDIO/RPD1/SCK1/RD1)
USBID: P3.4 U3.38(USBID/RPF3/RF3) U8.6(VBUS/ID)
NetD1_1: D1.1(A) R4.2
NetD2_1: D2.1(A) R5.2
NetD3_1: D3.1(A) R6.2
NetD5_1: D5.1(A) R9.2
NetD6_1: D6.1(A) R10.2
NetD7_1: D7.1(A) R11.2
NetL1_2: L1.2 P3.6
NetL7_1: L7.1 P3.1

Not connected (* = marked no-connect by the designer): P5 4* 5*; U2 15(PL10A)* 17(PL10B)* 19(PL10C)* 20(PL10D)* 27(PL17A)* 28(PL17B)* 31(PL18D)* 32(PL19A)* 33(PL19B)* 115(PT24B)* 117(PT24A)* 121(PT21B)* 132(PT14B)* 133(PT14A)* 140(PT10B)* 141(PT10A)*

### Layout directives
differential pair: FDIO0_N, FDIO0_P, FDIO1_N, FDIO1_P

### Notes on the sheet
- Teal-colored pins on the FPGA are pins which are available on the TQFP version, but not on the BGA version which we will ultimately use.
- PIC32 Decoupling
- Title:
- Asm:
- Date:
- Variant:
- Time:
- Number:
- Sheet
- of
- Rev:
- File:

### Library data of the parts
C10 C11 C13-C20 C62 = 1875: as C41 on sheet PSDT Power v1.0.0; Package: 0402; SMD: True; Date Modified: 11/6/2018 11:14:02 AM; Modified By: jrowley; Parent Key: 1875; Verified: False
C12 = 1876: as C31 on sheet PSDT Power v1.0.0; Package: 0402; SMD: True; Date Modified: 11/6/2018 11:19:13 AM; Modified By: jrowley; Voltage: 10; Parent Key: 1876; Verified: False
C30 = 1306: as C25 on sheet PSDT Power v1.0.0; Package: 0603; SMD: True; Date Modified: 3/3/2015 11:08:29 AM; Modified By: sotterbacher; Parent Key: 1306; Verified: True
D1-D3 D5-D7 = 798: Key: 798; MENG_PN: ???798; MANF: OSRAM; MANF_PN: LG L29K-F2J1-24; VENDOR: Digikey; VENDOR_PN: 475-1193-1-ND; P&V Description: LED, 1.7V, 0.02A, Green, 570nm, diffused, 0603, SMD; Class: LED; Other: Green, 570nm, diffused; Voltage: 1.7; Current: 0.02; Approved: True; Package: 0603; SMD: True; Date Modified: 11/4/2014 3:14:11 PM; Modified By: pmarcus; Parent Key: 798; Verified: True
DONE FCS FMISO FMOSI FSCK INTN JTEN PGMN = 49: as +1.8V on sheet PSDT Power v1.0.0; Type: Test Point; SMD: False; Date Modified: 9/30/2014 10:31:54 AM; Parent Key: 49; Verified: True; Modified By: sotterbacher
L1 L7 = 1818: Key: 1818; MENG_PN: ???1818; MANF: Murata; MANF_PN: BLM15PX331SN1D; VENDOR: Digikey; VENDOR_PN: 490-11022-1-ND; P&V Description: Inductor, Ferrite Bead, 1.2A, 330 Ohm at 100MHz, 0402, SMD; Other: 330 Ohm at 100MHz; Current: 1.2; Approved: False; Value: *; Class: Inductor; Type: Ferrite Bead; Package: 0402; SMD: True; Date Modified: 8/28/2018 10:47:21 PM; Modified By: jrowley; Parent Key: 1818; Verified: False
P1 = 1316: Key: 1316; MENG_PN: ???1316; MANF: Molex; MANF_PN: 53047-0510; VENDOR: Digikey; VENDOR_PN: WM1734-ND; P&V Description: Connector, PicoBlade, 5 Positions, Male, 0.049" Spacing, 1A, 125V, Vert, Through Hole, Locking, Tin; Class: Connector; Other: Vert, Through Hole, Locking, Tin; Current: 1; Voltage: 125; Positions: 5; Spacing: 0.049; Sex: Male; Approved: True; Type: PicoBlade; SMD: False; Date Modified: 4/3/2015 6:22:35 PM; Modified By: pmarcus; Parent Key: 1316; Verified: True
P2 = 1286: Key: 1286; MENG_PN: ???1286; MANF: Molex; MANF_PN: 53047-0310; VENDOR: Digikey; VENDOR_PN: WM1732-ND; P&V Description: Connector, PicoBlade, 3 Positions, Male, 0.049" Spacing, 1A, 125V, Vert, Through Hole, Locking, Tin; Class: Connector; Other: Vert, Through Hole, Locking, Tin; Current: 1; Voltage: 125; Positions: 3; Spacing: 0.049; Sex: Male; Approved: True; Type: PicoBlade; SMD: False; Date Modified: 2/19/2015 4:08:35 PM; Modified By: rlaity; Parent Key: 1286; Verified: True
P3 = 1830: Key: 1830; MENG_PN: ???1830; MANF: Amphenol FCI; MANF_PN: 10118192-0002LF; VENDOR: Digikey; VENDOR_PN: 609-5379-1-ND; P&V Description: Connector, USB, 5 Positions, Female, 0.026" Spacing, 1.8A, 100V, USB - micro B USB 2.0 Receptacle Connector 5 Position Surface Mount, Right Angle, Without Flange, SMD; Class: Connector; Other: USB - micro B USB 2.0 Receptacle Connector 5 Position Surface Mount, Right Angle, Without Flange; Positions: 5; Sex: Female; Approved: False; Current: 1.8; Voltage: 100; Spacing: 0.026; Type: USB; SMD: True; Date Modified: 8/31/2018 2:15:27 PM; Modified By: jrowley; Parent Key: 1830; Verified: False
P4 P5 P8 = 152: Key: 152; MENG_PN: CON00027; MANF: Molex; VENDOR: Digikey; VENDOR_PN: WM2706-ND; P&V Description: Connector, Header, 0.1", 8 Positions, Male, 0.1" Spacing, 4A, 250V, Vertical, 0.24" Long, 0.125" Tail, 15u" Select Gold, Polarized, Locking Ramp; Class: Connector; Other: Vertical, 0.24" Long, 0.125" Tail, 15u" Select Gold, Polarized, Locking Ramp; Current: 4; Voltage: 250; Positions: 8; Spacing: 0.1; Sex: Male; Approved: False; MANF_PN: 22-11-2082; Type: Header, 0.1"; SMD: False; Date Modified: 7/21/2017 2:27:29 PM; Modified By: jrowley; Parent Key: 152; Verified: False
P6 = 51: Key: 51; MENG_PN: CON00013; MANF: Molex; VENDOR: Digikey; VENDOR_PN: WM2704-ND; P&V Description: Connector, Header, 0.1", 6 Positions, Male, 0.1" Spacing, 4A, 250V, 0.24" Long, 0.125" Tail, 15u" Select Gold, Polarized, Locking Ramp, Vertical; Class: Connector; Other: 0.24" Long, 0.125" Tail, 15u" Select Gold, Polarized, Locking Ramp, Vertical; Current: 4; Voltage: 250; Positions: 6; Spacing: 0.1; Sex: Male; Approved: False; MANF_PN: 22-11-2062; Type: Header, 0.1"; SMD: False; Date Modified: 7/21/2017 2:26:33 PM; Modified By: jrowley; Parent Key: 51; Verified: False
P7 = 275: Key: 275; MENG_PN: CON00037; MANF: Molex; VENDOR: Digikey; VENDOR_PN: WM2708-ND; P&V Description: Connector, Header, 0.1", 10 Positions, Male, 0.1" Spacing, 4A, 250V, Vertical, 0.24" Long, 0.125" Tail, 15u" Select Gold, Polarized, Locking Ramp; Class: Connector; Other: Vertical, 0.24" Long, 0.125" Tail, 15u" Select Gold, Polarized, Locking Ramp; Current: 4; Voltage: 250; Positions: 10; Spacing: 0.1; Sex: Male; Approved: False; MANF_PN: 22-11-2102; Type: Header, 0.1"; SMD: False; Date Modified: 7/21/2017 2:28:18 PM; Modified By: jrowley; Parent Key: 275; Verified: False
R3 R7 R8 = 1806: KEY: 1806; MENG_PN: ???1806; MANF: Stackpole Electronics; MANF_PN: RMCF0402FT10K0; VENDOR: Digikey; VENDOR_PN: RMCF0402FT10K0CT-ND; P&V Description: Resistor, Thick Film, 10k Ohms, 0.0625W, 1% Tol, 100V, 0402, SMD; Class: Resistor; Tolerance: 1; Power: 0.0625; Voltage: 100; Approved: False; Type: Thick Film; Package: 0402; SMD: True; Date Modified: 8/27/2018 6:34:02 PM; Modified By: jrowley; Expr1026: 1806; Parent Key: 1806; Verified: False
R4-R6 R9-R11 = 1823: KEY: 1823; MENG_PN: ???1823; MANF: Yageo; MANF_PN: RC0402FR-07100RL; VENDOR: Digikey; VENDOR_PN: 311-100LRCT-ND; P&V Description: Resistor, Thick Film, 100 Ohms, 0.0625W, 1% Tol, 100V, 0402, SMD; Class: Resistor; Tolerance: 1; Power: 0.0625; Approved: False; Type: Thick Film; Package: 0402; SMD: True; Date Modified: 8/29/2018 2:46:23 AM; Modified By: jrowley; Voltage: 100; Expr1026: 1823; Parent Key: 1823; Verified: False
R12-R15 = 1871: Key: 1871; MENG_PN: ???1871; MANF: Yageo; MANF_PN: RC0402FR-074K99L; VENDOR: Digikey; VENDOR_PN: 311-4.99KLRCT-ND; P&V Description: Resistor, Thick Film, 4.99k Ohms, 0.063W, 1% Tol, RES SMD 4.99K OHM 1% 1/16W 0402, 0402, SMD; Class: Resistor; Other: RES SMD 4.99K OHM 1% 1/16W 0402; Tolerance: 1; Power: 0.063; Approved: False; Type: Thick Film; Package: 0402; SMD: True; Date Modified: 11/5/2018 1:44:43 PM; Modified By: khall; Expr1026: 1871; Parent Key: 1871; Verified: False
R16 R17 = 1892: Key: 1892; MANF: Stackpole Electronics; MANF_PN: RMCF0402FT2K32; VENDOR: Digikey; VENDOR_PN: RMCF0402FT2K32CT-ND; P&V Description: Resistor, Thick Film, 2.32k Ohms, 0.0625W, 1% Tol, 2.32 kOhms ±1% 0.063W, 1/16W Chip Resistor 0402 (1005 Metric) Automotive AEC-Q200 Thick Film, 0402, SMD; Class: Resistor; Other: 2.32 kOhms ±1% 0.063W, 1/16W Chip Resistor 0402 (1005 Metric) Automotive AEC-Q200 Thick Film; Tolerance: 1; Power: 0.0625; Approved: False; MENG_PN: 1892; Type: Thick Film; Package: 0402; SMD: True; Date Modified: 12/12/2018 9:31:20 AM; Modified By: khall; Expr1026: 1892; Parent Key: 1892; Verified: False
S1-S4 = 1672: Key: 1672; MENG_PN: ???1672; MANF: C&K Components; MANF_PN: PTS645SK50SMTR92 LFS; VENDOR: Digikey; VENDOR_PN: CKN9087CT-ND; P&V Description: Switch, Tactile, Top Actuated, 0.05A, 260 grams, No Pegs, No ESD, 6x6mm, SMD; Class: Switch; Other: Top Actuated, 0.05A, 260 grams, No Pegs, No ESD; Approved: False; Type: Tactile; Package: 6x6mm; SMD: True; Date Modified: 5/24/2018 2:12:47 PM; Modified By: jrowley; Parent Key: 1672; Verified: True
U2 = MachXO2-4000-TG144: as U2 on sheet PSDT Power v1.0.0
U3 = PIC32MZ2048EFH064-I/PT: Microchip PIC32MZ EF Series 64-pin; VENDOR_PN: PIC32MZ2048EFH064-I/PT-ND; MANF: Microchip Technology; VENDOR: DigiKey; MANF_PN: PIC32MZ2048EFH064-I/PT
U7 = 2055: Key: 2055; MENG_PN: ???2055; MANF: Microchip; MANF_PN: DSC6011JI1A-024.0000; VENDOR: Digikey; VENDOR_PN: DSC6011JI1A-024.0000-ND; P&V Description: IC, Oscillator, 24MHz XO (Standard) CMOD Oscillator, 1.71-3.63V, Standby (Power Down), 4-SMD, SMD; Class: IC; Other: 24MHz XO (Standard) CMOD Oscillator, 1.71-3.63V, Standby (Power Down); Approved: False; Type: Oscillator; Package: 4-SMD; SMD: True; Date Modified: 6/13/2019 1:30:40 AM; Modified By: jrowley; Parent Key: 2055; Verified: False
U8 = 2056: Key: 2056; MENG_PN: ???2056; MANF: On Semiconductor; MANF_PN: EMI2121MTTAG; VENDOR: Digikey; VENDOR_PN: EMI2121MTTAGOSCT-ND; P&V Description: IC, Channel Protector, USB Common-Mode Filter and ESD Protection, WDFN-8, SMD; Class: IC; Other: USB Common-Mode Filter and ESD Protection; Approved: False; Type: Channel Protector; Package: WDFN-8; SMD: True; Date Modified: 6/13/2019 8:04:40 AM; Modified By: jrowley; Parent Key: 2056; Verified: False

## Sheet PSDT ADC v1.0.0.SchDoc: Probe-Scope Digital Test: ADC
size Tabloid; CompanyName: Probe-Scope; Organization: Probe-Scope; Address1: Probe-Scope: Unified USB; Address2: Oscilloscope Probe; Address3: ©2019 M. Omo, J. Rowley,; Address4: K. Hall, released under the; DocumentNumber: SCH0020; SheetNumber: 2; SheetTotal: 4; PageSetup: Record=PageOptions|CenterHorizontal=True|CenterVertical=True|PrintScale=0.96|XCorrection=1.00|YCorrection=1.00|PrintKind=1|BorderSize=5000000|LeftOffset=0|BottomOffset=0|Orientation=2|PaperLength=1000|PaperWidth=1000|Scale=100|PaperSource=7|PrintQuality=-4|MediaType=1|DitherType=10|PaperKind=11x17|PrintScaleMode=1; Assembly: ASP0020; License: CERN OHL v1.2
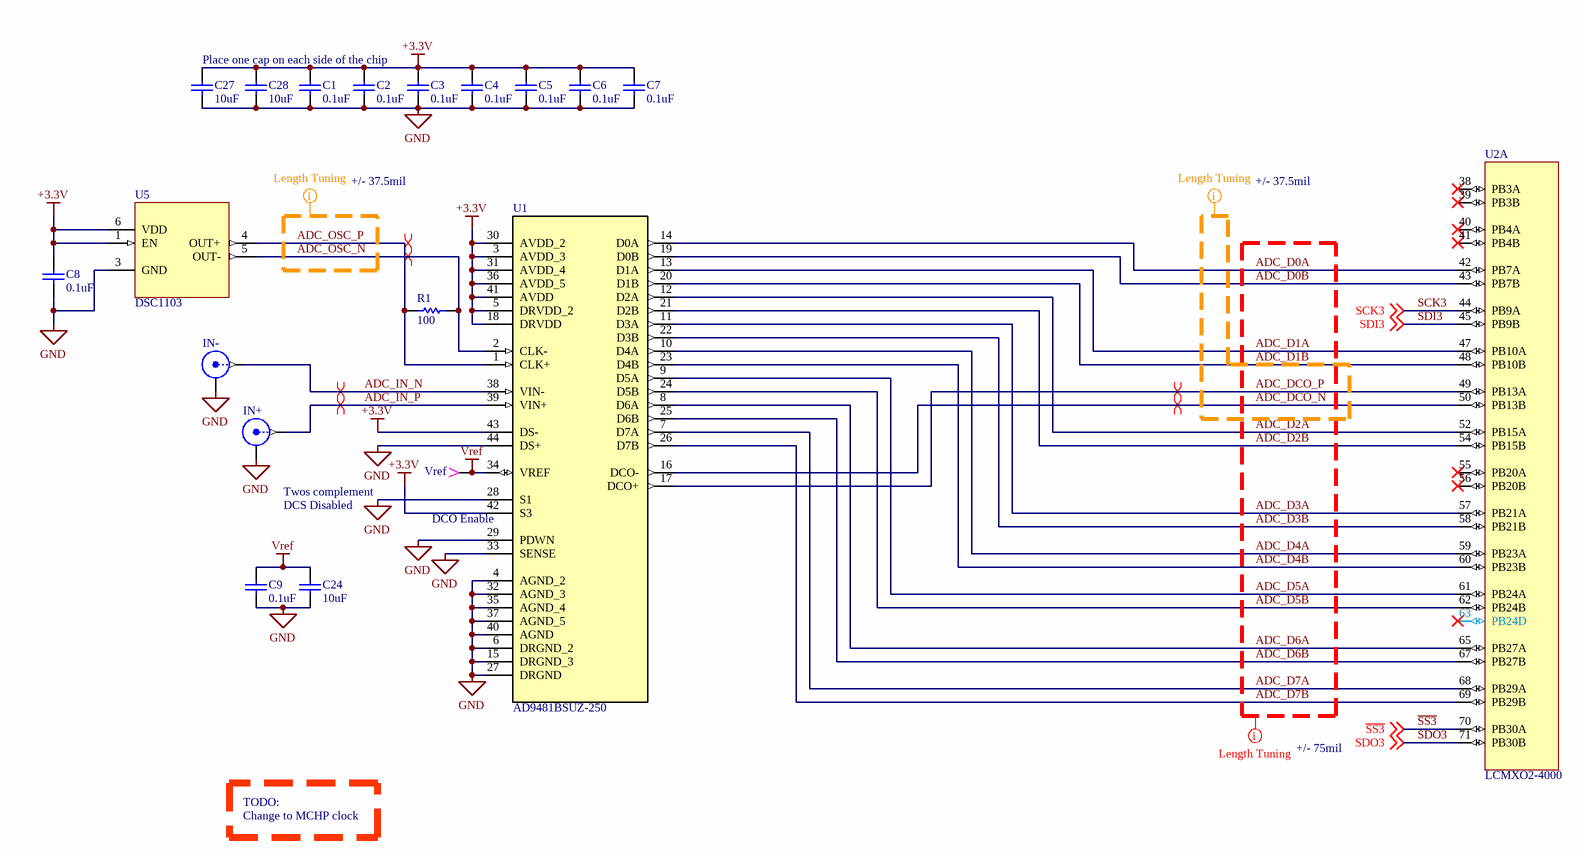
[diagram p3: PSDT ADC v1.0.0.SchDoc]

### Parts
C1  value 0.1uF  [0402(1005)]  (hidden comment: 6.3V)
C2  value 0.1uF  [0402(1005)]  (hidden comment: 6.3V)
C3  value 0.1uF  [0402(1005)]  (hidden comment: 6.3V)
C4  value 0.1uF  [0402(1005)]  (hidden comment: 6.3V)
C5  value 0.1uF  [0402(1005)]  (hidden comment: 6.3V)
C6  value 0.1uF  [0402(1005)]  (hidden comment: 6.3V)
C7  value 0.1uF  [0402(1005)]  (hidden comment: 6.3V)
C8  value 0.1uF  [0402(1005)]  (hidden comment: 6.3V)
C9  value 0.1uF  [0402(1005)]  (hidden comment: 6.3V)
C24  value 10uF  [0603(1608)]  (hidden comment: 25V)
C27  value 10uF  [0603(1608)]  (hidden comment: 25V)
C28  value 10uF  [0603(1608)]  (hidden comment: 25V)
IN+  SMA  [TE SMA Stright]  (value not drawn)
IN-  SMA  [TE SMA Stright]  (value not drawn)
R1  value 100  [0402(1005)]  (hidden comment: Res1)
U1  AD9481BSUZ-250  [QFP80P1200X1200X120-44N]
U2  LCMXO2-4000  [UL_TQFP144]  (part A of 5)
U5  DSC1103  [MCHP_H5A]
Vref  TP  [TESTPOINT024]  (value not drawn)

### Nets
+3.3V: C1.2 C2.2 C3.2 C4.2 C5.2 C6.2 C7.2 C8.2 C27.2 C28.2 U1.3(AVDD_3) U1.5(DRVDD_2) U1.18(DRVDD) U1.30(AVDD_2) U1.31(AVDD_4) U1.36(AVDD_5) U1.41(AVDD) U1.42(S3) U1.43(DS-) U5.1(EN) U5.6(VDD)
GND: C1.1 C2.1 C3.1 C4.1 C5.1 C6.1 C7.1 C8.1 C9.1 C24.1 C27.1 C28.1 IN+.2(Y) IN-.2(Y) U1.4(AGND_2) U1.6(DRGND_2) U1.15(DRGND_3) U1.27(DRGND) U1.28(S1) U1.29(PDWN) U1.32(AGND_3) U1.33(SENSE) U1.35(AGND_4) U1.37(AGND_5) U1.40(AGND) U1.44(DS+) U5.3(GND)
Vref: C9.2 C24.2 U1.34(VREF) Vref.1
ADC_D0A: U1.14(D0A) U2.42(PB7A)
ADC_D0B: U1.19(D0B) U2.43(PB7B)
ADC_D1A: U1.13(D1A) U2.47(PB10A)
ADC_D1B: U1.20(D1B) U2.48(PB10B)
ADC_D2A: U1.12(D2A) U2.52(PB15A)
ADC_D2B: U1.21(D2B) U2.54(PB15B)
ADC_D3A: U1.11(D3A) U2.57(PB21A)
ADC_D3B: U1.22(D3B) U2.58(PB21B)
ADC_D4A: U1.10(D4A) U2.59(PB23A)
ADC_D4B: U1.23(D4B) U2.60(PB23B)
ADC_D5A: U1.9(D5A) U2.61(PB24A)
ADC_D5B: U1.24(D5B) U2.62(PB24B)
ADC_D6A: U1.8(D6A) U2.65(PB27A)
ADC_D6B: U1.25(D6B) U2.67(PB27B)
ADC_D7A: U1.7(D7A) U2.68(PB29A)
ADC_D7B: U1.26(D7B) U2.69(PB29B)
ADC_DCO_N: U1.16(DCO-) U2.50(PB13B)
ADC_DCO_P: U1.17(DCO+) U2.49(PB13A)
ADC_IN_N: IN-.1(X) U1.38(VIN-)
ADC_IN_P: IN+.1(X) U1.39(VIN+)
ADC_OSC_N: R1.2 U1.2(CLK-) U5.5(OUT-)
ADC_OSC_P: R1.1 U1.1(CLK+) U5.4(OUT+)
~{SS3}: U2.70(PB30A) ; off-sheet ~{SS3}
SCK3: U2.44(PB9A) ; off-sheet SCK3
SDI3: U2.45(PB9B) ; off-sheet SDI3
SDO3: U2.71(PB30B) ; off-sheet SDO3

Not connected (* = marked no-connect by the designer): U2 38(PB3A)* 39(PB3B)* 40(PB4A)* 41(PB4B)* 55(PB20A)* 56(PB20B)* 63(PB24D)*

### Layout directives
differential pair: ADC_DCO_N, ADC_DCO_P, ADC_IN_N, ADC_IN_P, ADC_OSC_N, ADC_OSC_P
net class ADC_DATA - 150mil: ADC_D0A, ADC_D0B, ADC_D1A, ADC_D1B, ADC_D2A, ADC_D2B, ADC_D3A, ADC_D3B, ADC_D4A, ADC_D4B, ADC_D5A, ADC_D5B, ADC_D6A, ADC_D6B, ADC_D7A, ADC_D7B, ADC_DCO_N, ADC_DCO_P
net class ADC_CLK - 37.5mil: ADC_D1B, ADC_DCO_N, ADC_DCO_P
net class ADC_OSC - 37.5mil: ADC_OSC_N, ADC_OSC_P

### Notes on the sheet
- Place one cap on each side of the chip
- +/- 37.5mil
- (near IN+) Twos complement
- DCS Disabled
- (near U1) DCO Enable
- +/- 75mil
- TODO:
- Change to MCHP clock
- Title:
- Asm:
- Date:
- Variant:
- Time:
- Number:
- Sheet
- of
- Rev:
- File:

### Library data of the parts
C1-C9 = 1875: as C41 on sheet PSDT Power v1.0.0; Package: 0402; SMD: True; Date Modified: 11/6/2018 11:14:02 AM; Modified By: jrowley; Parent Key: 1875; Verified: False
C24 C27 C28 = 1306: as C25 on sheet PSDT Power v1.0.0; Package: 0603; SMD: True; Date Modified: 3/3/2015 11:08:29 AM; Modified By: sotterbacher; Parent Key: 1306; Verified: True
IN+ IN- = 968: Key: 968; MENG_PN: ???968; MANF: TE Connectivity; MANF_PN: 5-1814832-1; VENDOR: Digikey; VENDOR_PN: A97594-ND; P&V Description: Connector, SMA, 1 Positions, Female, Vertical.  50 Ohm.  3 GHz.; Class: Connector; Other: Vertical.  50 Ohm.  3 GHz.; Positions: 1; Sex: Female; Approved: True; Type: SMA; SMD: False; Date Modified: 5/28/2013 3:41:34 PM; Modified By: rlaity; Parent Key: 968; Verified: True
R1 = 1823: Key: 1823; MENG_PN: ???1823; MANF: Yageo; MANF_PN: RC0402FR-07100RL; VENDOR: Digikey; VENDOR_PN: 311-100LRCT-ND; P&V Description: Resistor, Thick Film, 100 Ohms, 0.0625W, 1% Tol, 100V, 0402, SMD; Class: Resistor; Tolerance: 1; Power: 0.0625; Approved: False; Type: Thick Film; Package: 0402; SMD: True; Date Modified: 8/29/2018 2:46:23 AM; Modified By: jrowley; Voltage: 100; Expr1026: 1823; Parent Key: 1823; Verified: False
U1 = AD9481BSUZ-250: Single ADC Pipelined 250Msps 8-bit Parallel/LVDS 44-Pin TQFP Tray; VENDOR: DigiKey; MANF: Analog Devices Inc.; VENDOR_PN: AD9481BSUZ-250-ND; MANF_PN: AD9481BSUZ-250
U2 = MachXO2-4000-TG144: as U2 on sheet PSDT Power v1.0.0
U5 = DSC1103: VENDOR: Mouser; MANF: Microchip Technology; MANF_PN: DSC1103CI3-250.0000; VENDOR_PN: 579-1103CI32500000
Vref = 49: as +1.8V on sheet PSDT Power v1.0.0; Type: Test Point; SMD: False; Date Modified: 9/30/2014 10:31:54 AM; Parent Key: 49; Verified: True; Modified By: sotterbacher

## Nets that join several sheets
+1.8V: PSDT Power v1.0.0 (11 pins), PSDT RAM v1.0.0 (7 pins)
+3.3V: PSDT Power v1.0.0 (37 pins), PSDT Controller v1.0.0 (31 pins), PSDT ADC v1.0.0 (21 pins)
+5V_USB: PSDT Power v1.0.0 (5 pins), PSDT Controller v1.0.0 (C12.2 C13.2 L7.2 U3.33)
GND: PSDT Power v1.0.0 (42 pins), PSDT RAM v1.0.0 (7 pins), PSDT Controller v1.0.0 (47 pins), PSDT ADC v1.0.0 (27 pins)
~{SS3}: PSDT Controller v1.0.0 (FCS.1 U3.18), PSDT ADC v1.0.0 (U2.70)
SCK3: PSDT Controller v1.0.0 (FSCK.1 U3.29), PSDT ADC v1.0.0 (U2.44)
SDI3: PSDT Controller v1.0.0 (FMISO.1 U3.57), PSDT ADC v1.0.0 (U2.45)
SDO3: PSDT Controller v1.0.0 (FMOSI.1 U3.56), PSDT ADC v1.0.0 (U2.71)

## Assembly variants
Standard Configuration: all parts fitted